# EAGLE design GamePad-PadPCB_v01 (EAGLE 9.0.0)
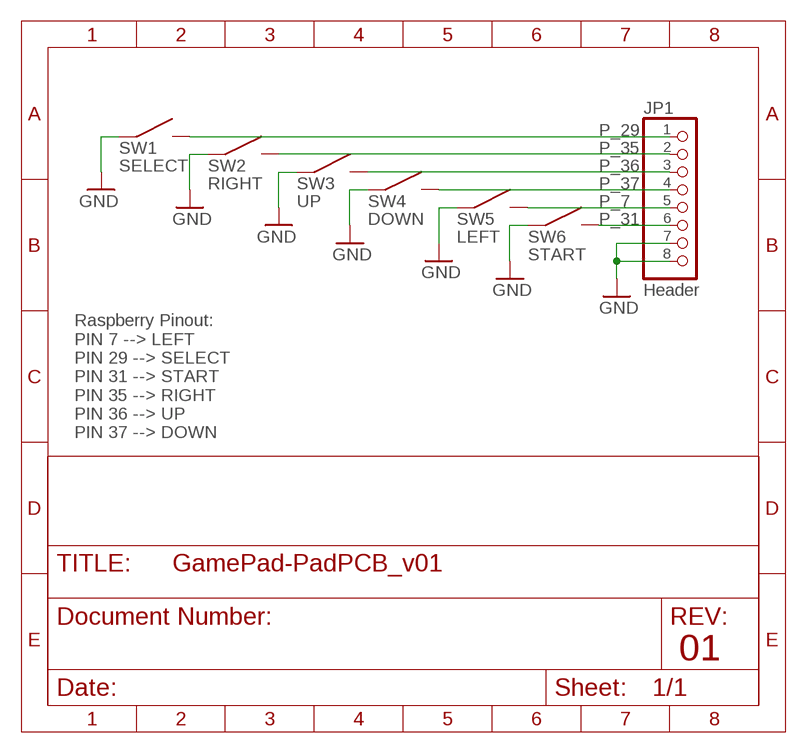
[diagram p0: schematic, sheet 1]

## Parts
JP1  Header  PINHD-1X8  [1X08]
SW1  SELECT  EVPAS  [EVPA]
SW2  RIGHT  EVPAS  [EVPA]
SW3  UP  EVPAS  [EVPA]
SW4  DOWN  EVPAS  [EVPA]
SW5  LEFT  EVPAS  [EVPA]
SW6  START  EVPAS  [EVPA]

## Nets
GND: JP1.7 JP1.8 SW1.1 SW2.1 SW3.1 SW4.1 SW5.1 SW6.1
P_7: JP1.5 SW5.2
P_29: JP1.1 SW1.2
P_31: JP1.6 SW6.2
P_35: JP1.2 SW2.2
P_36: JP1.3 SW3.2
P_37: JP1.4 SW4.2

## Notes on the sheet
- Raspberry Pinout:
  PIN 7 --> LEFT
  PIN 29 --> SELECT
  PIN 31 --> START
  PIN 35 --> RIGHT
  PIN 36 --> UP
  PIN 37 --> DOWN
- 01

## Library data of the parts
JP1 = pinhead:PINHD-1X8: PIN HEADER
SW1-SW6 = Buttons:EVPAS

## Net classes
0 default: width 0.305 mm, drill 0.508 mm, clearance 0.254 mm

## Board
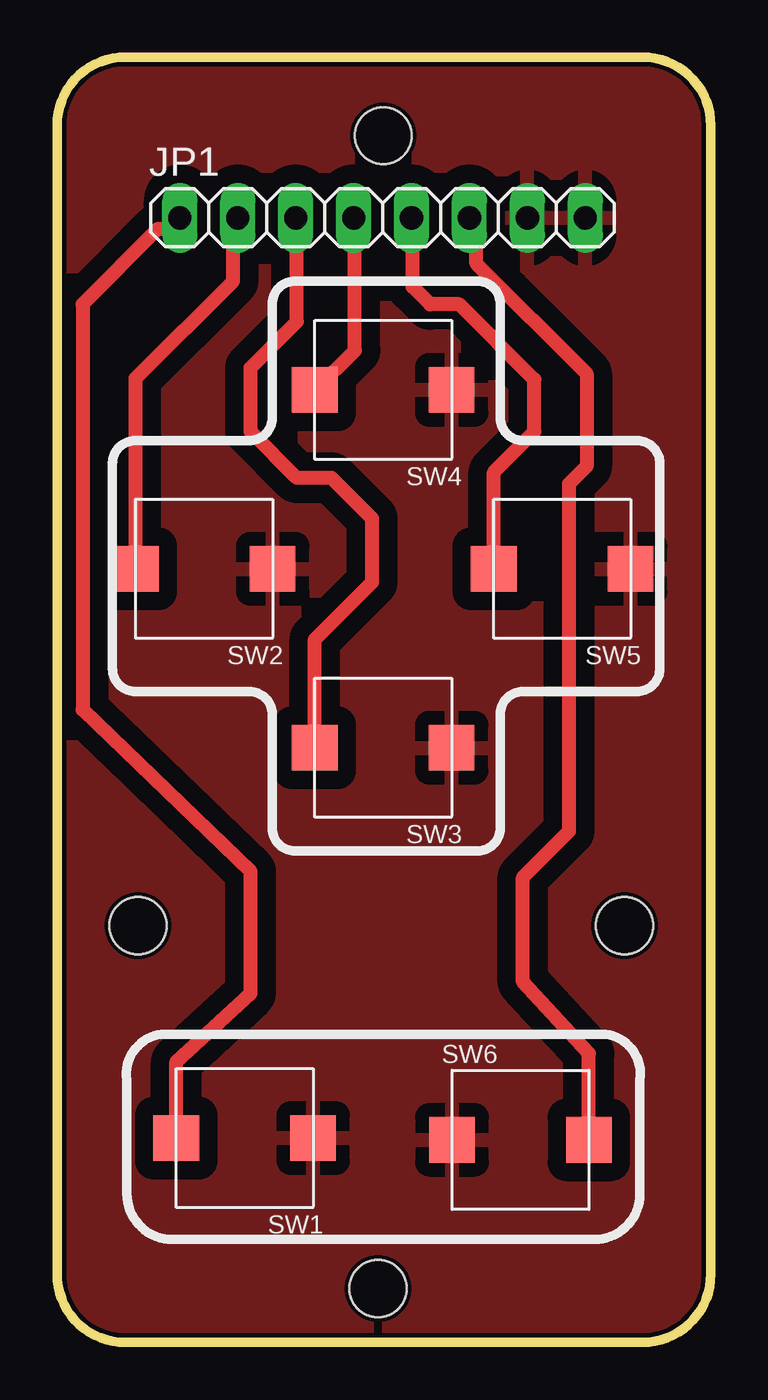
[diagram p1: board, top side]

Size 28.66 x 56.38 mm. Coordinates in mm from the lower left corner, seen from the top.
Outline: 28.66,53.38 28.66,3 arc-90 25.66,0 3,0 arc-90 0,3 0,53.38 arc-90 3,56.38 25.66,56.38 arc-90 28.66,53.38
Copper layers (1*16): Top 0.035mm / dielectric 1.5mm / Bottom 0.035mm
Design rules "VG_CNC": minimum track width 8mil, minimum drill 15.5mil, track to track 32mil, track to pad 32mil, pad to pad 32mil, via to via 32mil, smd to smd 32mil, copper to edge 8mil, drill to drill 8mil, minimum pad ring 10mil, minimum via ring 8mil, stop-mask expansion 2mil, vias tented up to drill 20mil, thermal gap 24mil
Holes 2.5 mm at 3.56,18.29 24.88,18.29 14.07,2.36 14.3,52.93

### Footprints (pad centres in the part's own frame; a part is rotated, then mirrored left to right if it is on the bottom)
1X08 = drill 1.016 long: 1 -8.89,0; 2 -6.35,0; 3 -3.81,0; 4 -1.27,0; 5 1.27,0; 6 3.81,0; 7 6.35,0; 8 8.89,0
EVPA = smd 2 x 2: 1 -3,0; 2 3,0

### Placement (x,y rotation side)
JP1  14.27,49.33 0 top
SW1  8.23,8.97 180 top
SW2  6.45,33.93 180 top
SW3  14.3,26.09 180 top
SW4  14.3,41.78 180 top
SW5  22.15,33.93 180 top
SW6  20.32,8.89 0 top

### Tracks (layer width: path | path; a pad name or v marks a point on that pad's centre or on a via)
GND
  pour Top: -1.68,57.48 28.55,57.48 32.36,53.67 32.36,1.09 28.8,-2.46 -0.15,-2.46 -2.95,0.33 -2.95,56.21
P_7
  Top 0.61: SW5.2 19.15,38.17 20.93,39.95 20.93,42.24 17.63,45.54 16.36,45.54 15.6,46.3 15.6,49.28 JP1.5
P_29
  Top 0.61: SW1.2 5.23,12.32 8.48,15.32 8.48,20.65 1.12,27.76 1.12,45.54 4.42,48.84 4.9,48.84 JP1.1
P_31
  Top 0.61: JP1.6 18.39,49.02 18.39,47.32 23.22,42.49 23.22,38.43 22.45,37.67 22.45,22.43 20.42,20.4 20.42,15.82 23.32,12.67 SW6.2
P_35
  Top 0.61: SW2.2 3.45,42.29 7.72,46.56 7.72,49.12 JP1.2
P_36
  Top 0.61: SW3.2 11.3,30.83 13.82,33.35 13.82,36.14 12.04,37.92 10.52,37.92 8.48,39.95 8.48,42.75 10.52,44.78 10.52,49.28 JP1.3
P_37
  Top 0.61: SW4.2 11.33,41.78 13.06,43.51 13.06,49.28 JP1.4